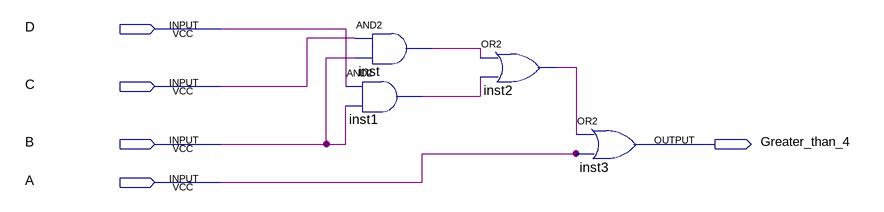
[diagram p0: schematic sheet]
// Quartus schematic greater_than_4.bdf as structural Verilog: 4 symbols, 5 pins
module greater_than_4 (
  input  D,
  input  C,
  input  B,
  input  A,
  output Greater_than_4
);

  wire inst1_out, inst2_out, inst_out;

  and inst (inst_out, C, B);
  and inst1 (inst1_out, D, B);
  or inst2 (inst2_out, inst_out, inst1_out);
  or inst3 (Greater_than_4, inst2_out, A);
endmodule
